# EAGLE design C3427-1 (EAGLE 7.2.0)
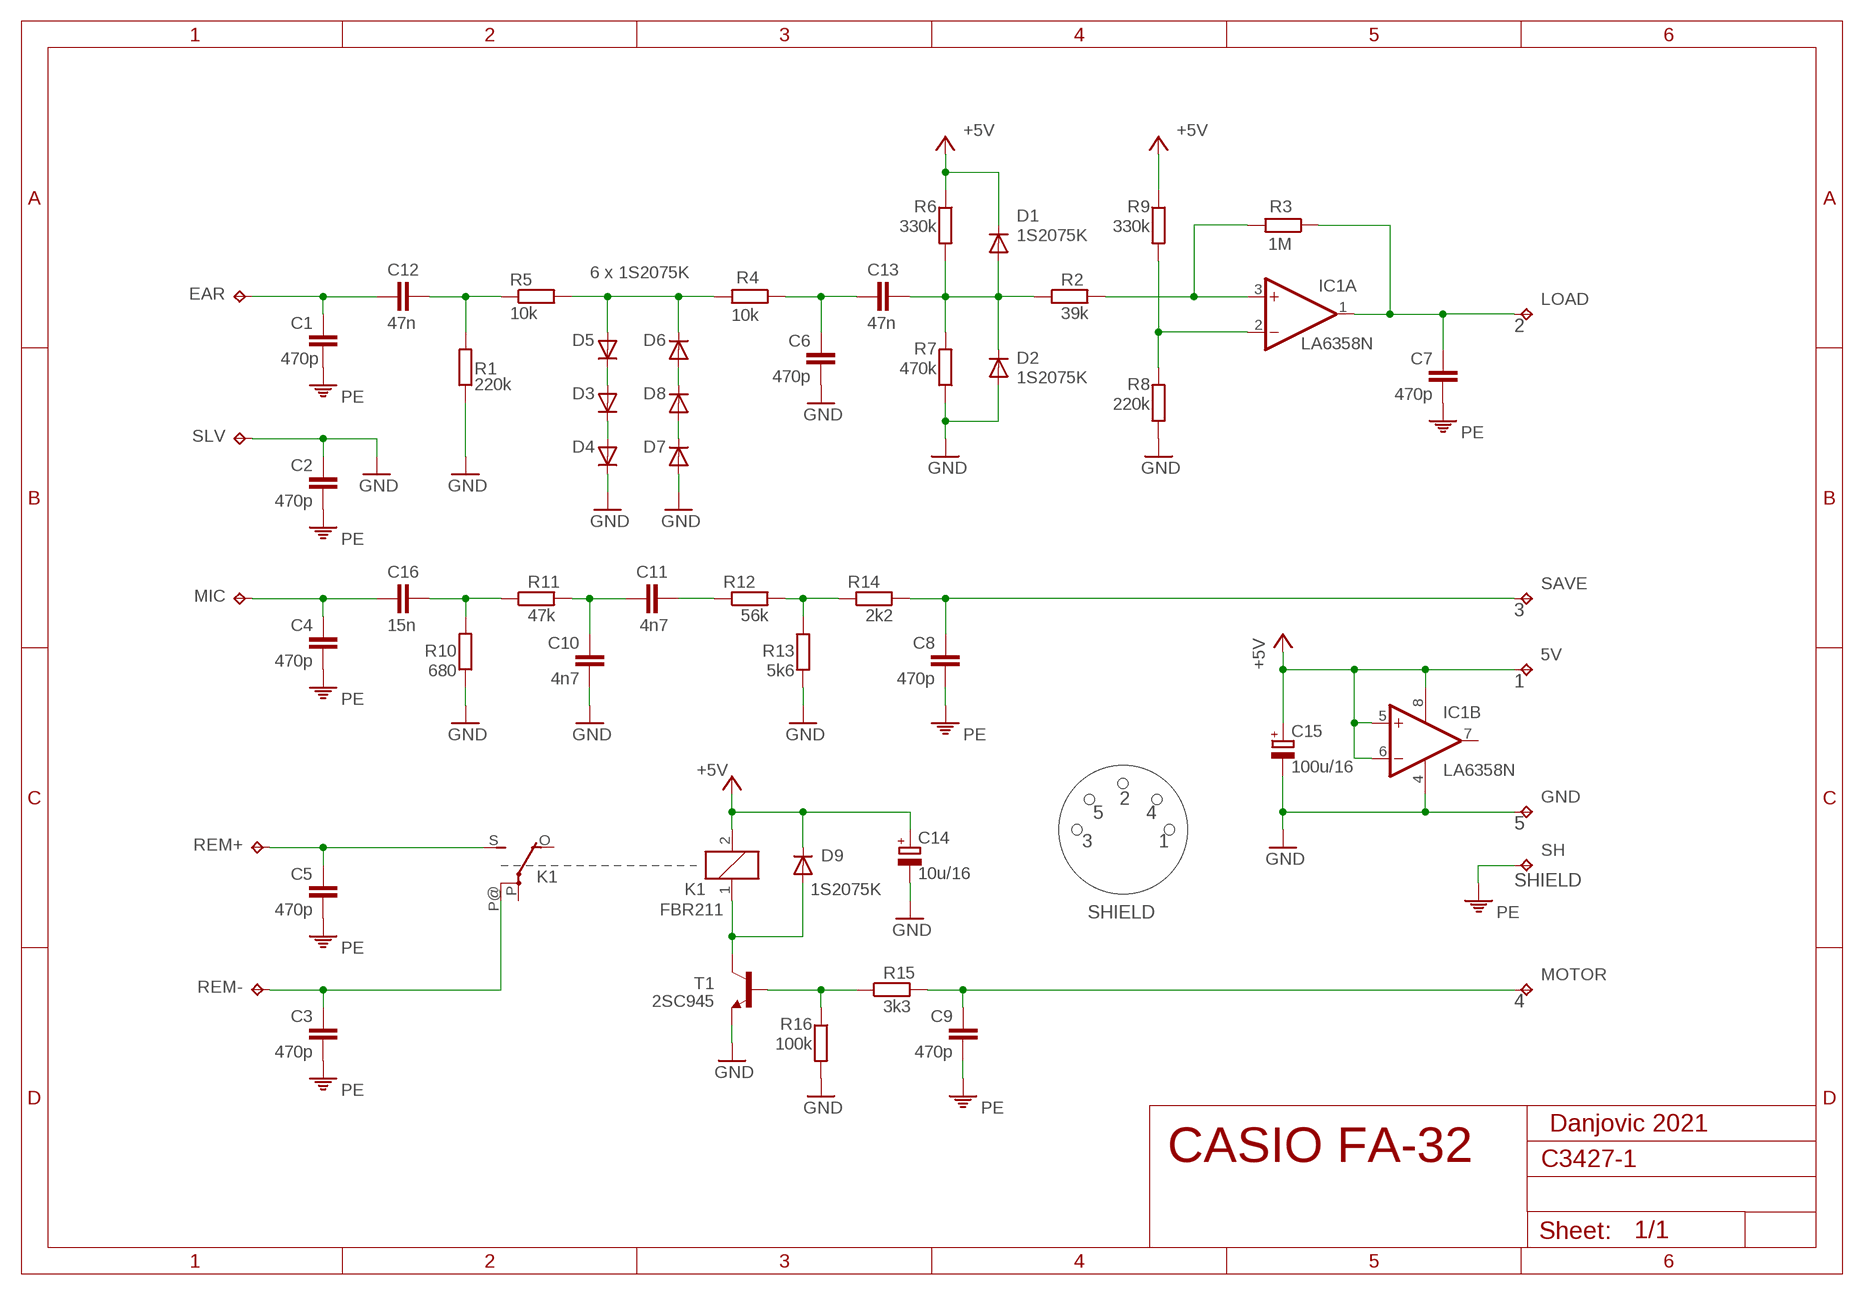
[diagram p0: schematic, sheet 1]

## Parts
5V  TPPAD1-13  [P1-13]
C1  470p  C-EU050-024X044  [C050-024X044]
C2  470p  C-EU050-024X044  [C050-024X044]
C3  470p  C-EU050-024X044  [C050-024X044]
C4  470p  C-EU050-024X044  [C050-024X044]
C5  470p  C-EU050-024X044  [C050-024X044]
C6  470p  C-EU050-024X044  [C050-024X044]
C7  470p  C-EU050-024X044  [C050-024X044]
C8  470p  C-EU050-024X044  [C050-024X044]
C9  470p  C-EU050-024X044  [C050-024X044]
C10  4n7  C-EU050-024X044  [C050-024X044]
C11  4n7  C-EU050-024X044  [C050-024X044]
C12  47n  C-EU050-045X075  [C050-045X075]
C13  47n  C-EU050-045X075  [C050-045X075]
C14  10u/16  CPOL-EUE2-4  [E2-4]
C15  100u/16  CPOL-EUE2.5-6  [E2,5-6]
C16  15n  C-EU050-024X044  [C050-024X044]
D1  1S2075K  DIODE-D-7.5  [D-7.5]
D2  1S2075K  DIODE-D-7.5  [D-7.5]
D3  1S2075K  DIODE-D-7.5  [D-7.5]
D4  1S2075K  DIODE-D-7.5  [D-7.5]
D5  1S2075K  DIODE-D-7.5  [D-7.5]
D6  1S2075K  DIODE-D-7.5  [D-7.5]
D7  1S2075K  DIODE-D-7.5  [D-7.5]
D8  1S2075K  DIODE-D-7.5  [D-7.5]
D9  1S2075K  DIODE-D-7.5  [D-7.5]
EAR  TPPAD1-13  [P1-13]
GND  TPPAD1-13  [P1-13]
IC1  LA6358N  LM358N  [DIL08]
K1  FBR211  FRS1B  [FRS1B]
LOAD  TPPAD1-13  [P1-13]
MIC  TPPAD1-13  [P1-13]
MOTOR  TPPAD1-13  [P1-13]
R1  220k  R-EU_0204/7  [0204/7]
R2  39k  R-EU_0204/7  [0204/7]
R3  1M  R-EU_0204/7  [0204/7]
R4  10k  R-EU_0204/7  [0204/7]
R5  10k  R-EU_0204/7  [0204/7]
R6  330k  R-EU_0204/7  [0204/7]
R7  470k  R-EU_0204/7  [0204/7]
R8  220k  R-EU_0204/7  [0204/7]
R9  330k  R-EU_0204/7  [0204/7]
R10  680  R-EU_0204/7  [0204/7]
R11  47k  R-EU_0204/7  [0204/7]
R12  56k  R-EU_0204/7  [0204/7]
R13  5k6  R-EU_0204/7  [0204/7]
R14  2k2  R-EU_0204/7  [0204/7]
R15  3k3  R-EU_0204/7  [0204/7]
R16  100k  R-EU_0204/7  [0204/7]
REM+  TPPAD1-13  [P1-13]
REM-  TPPAD1-13  [P1-13]
SAVE  TPPAD1-13  [P1-13]
SH  TPPAD1-13  [P1-13]
SLV  TPPAD1-13  [P1-13]
T1  2SC945  [TO92-ECB]

## Nets
+5V: 5V.TP C14.+ C15.+ D1.C D9.C IC1.5(B:+IN) IC1.6(B:-IN) IC1.8(P:V+) K1.2 R6.1 R9.1
GND: C2.2 C6.1 C10.1 C14.- C15.- D2.A D4.C D7.A GND.TP IC1.4(P:V-) R1.1 R7.1 R8.1 R10.1 R13.2 R16.2 SLV.TP T1.E
N$1: C1.2 C12.2 EAR.TP
N$2: D5.A D6.C R4.2 R5.2
N$3: C12.1 R1.2 R5.1
N$4: C6.2 C13.2 R4.1
N$5: C16.1 R10.2 R11.1
N$6: C4.2 C16.2 MIC.TP
N$7: C3.2 K1.P@(2:P) REM-.TP
N$8: C5.2 K1.S(2:S) REM+.TP
N$9: D9.A K1.1 T1.C
N$10: R15.1 R16.1 T1.B
N$11: C9.2 MOTOR.TP R15.2
N$13: C7.2 IC1.1(A:OUT) LOAD.TP R3.1
N$14: C8.2 R14.2 SAVE.TP
N$15: D3.A D5.C
N$16: D3.C D4.A
N$17: D6.A D8.C
N$18: D7.C D8.A
N$19: C13.1 D1.A D2.C R2.1 R6.2 R7.2
N$20: R12.2 R13.1 R14.1
N$21: C10.2 C11.1 R11.2
N$22: C11.2 R12.1
N$23: IC1.2(A:-IN) R8.2 R9.2
N$25: IC1.3(A:+IN) R2.2 R3.2
PE: C1.1 C2.1 C3.1 C4.1 C5.1 C7.1 C8.1 C9.1 SH.TP
Unconnected: IC1.7(B:OUT) K1.O(2:O) K1.P(2:P)

## Notes on the sheet
- 6 x 1S2075K
- 2
- 3
- 1
- 2
- 5 | 4
- 5
- 3 | 1
- SHIELD
- SHIELD
- 4
- Danjovic 2021
- CASIO FA-32

## Library data of the parts
5V EAR GND LOAD MIC MOTOR REM+ REM- SAVE SH SLV = testpad:TP: Test pad
C1-C13 C16 = rcl:C-EU: CAPACITOR, European symbol
C14 C15 = rcl:CPOL-EU: POLARIZED CAPACITOR, European symbol
D1-D9 = diode:DIODE-: DIODE
IC1 = linear:LM358: OP AMP also LM158; LM258; LM2904 Source: http://cache.national.com/ds/LM/LM158.pdf
K1 = relay:FRS1B: RELAY 1 x switch, same as V23101-D6-A201, Siemens; OC_FARNELL: unknown; OC_NEWARK: unknown
R1-R16 = resistor:R-EU_: RESISTOR, European symbol
T1 = transistor:2SC945: NPN Silicon Epitaxial Planar Transistor Source: SEMTECH ELECTRONICS LTD. ... 2SC945 2.pdf

## Board
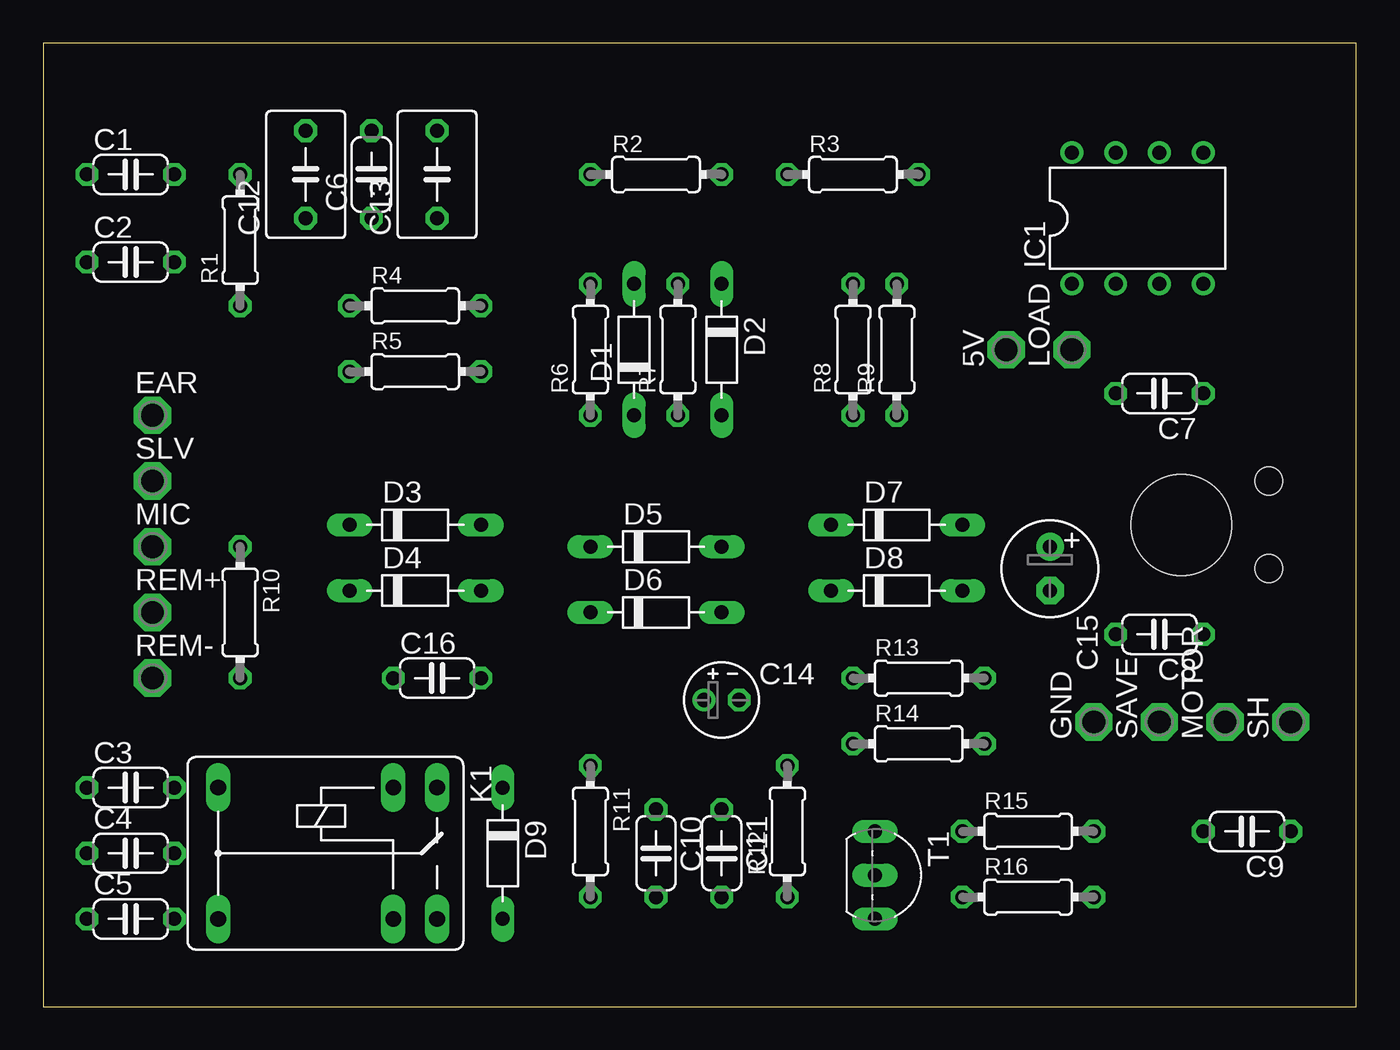
[diagram p1: board, top side]
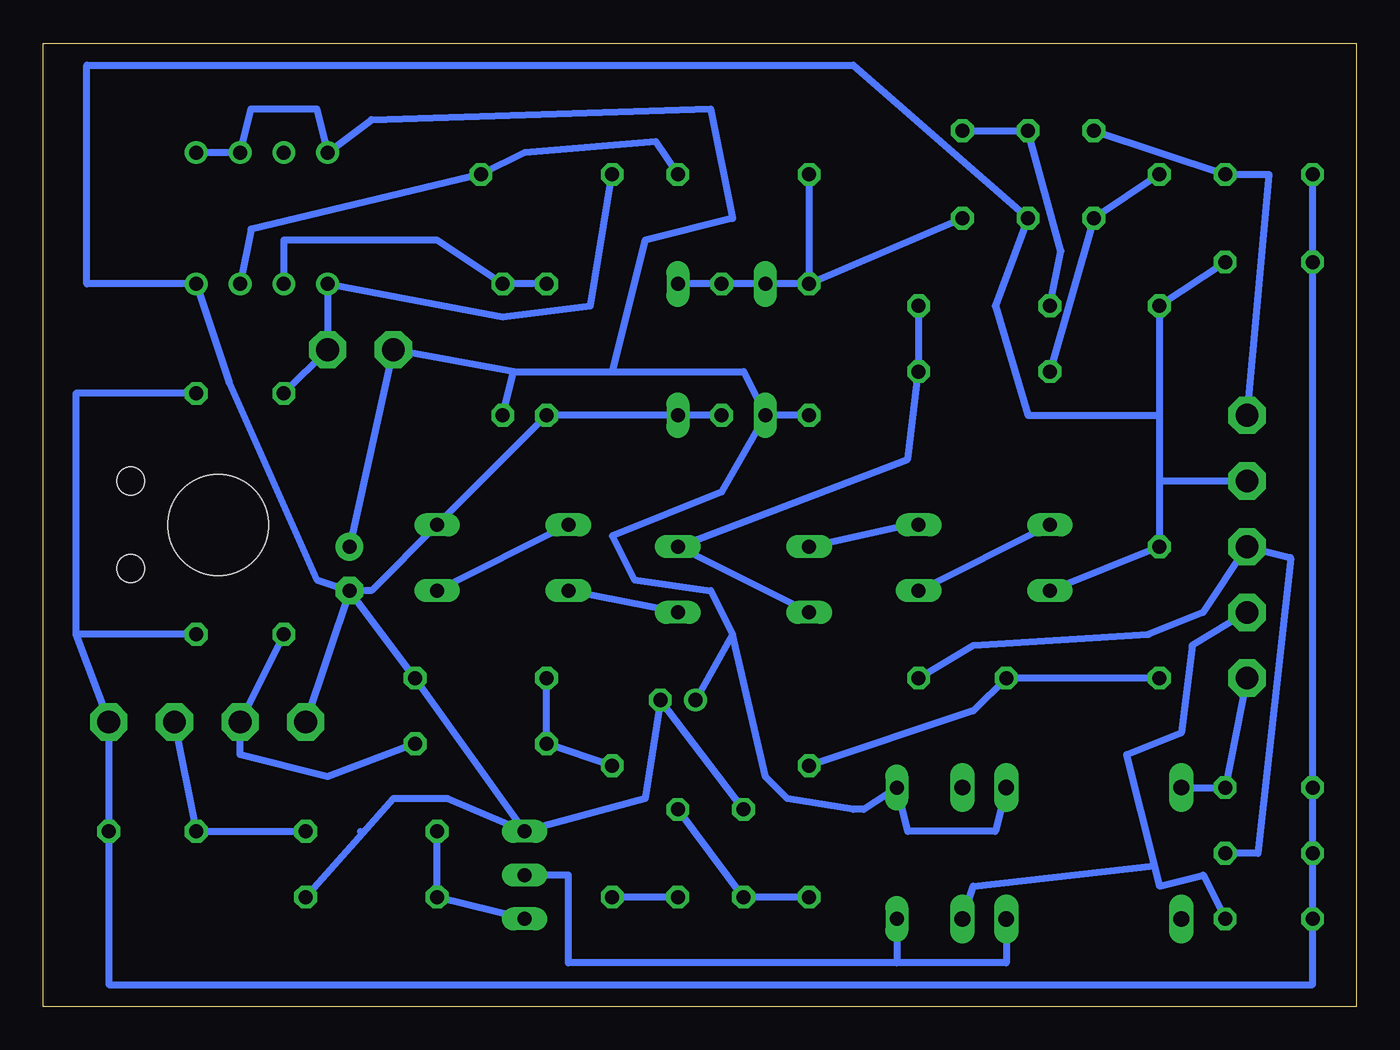
[diagram p2: board, bottom side, seen from below]

Size 76.2 x 55.88 mm. Coordinates in mm from the lower left corner, seen from the top.
Outline: 0,0 76.2,0 76.2,55.88 0,55.88 0,0
Copper layers (1*16): Top 0.035mm / dielectric 1.5mm / Bottom 0.035mm
Design rules "default": minimum track width 10mil, minimum drill 24mil, track to track 8mil, track to pad 8mil, pad to pad 8mil, via to via 8mil, smd to smd 8mil, copper to edge 40mil, drill to drill 8mil, minimum pad ring 10mil, minimum via ring 8mil, stop-mask expansion 4mil, vias tented up to drill 0mil, thermal gap 10mil
Holes 5.84 mm at 66.04,27.94
Holes 1.6 mm at 71.12,30.48 71.12,25.4

### Footprints (pad centres in the part's own frame; a part is rotated, then mirrored left to right if it is on the bottom)
P1-13 = drill 1.321 pad 2.159 octagon: TP 0,0
C050-024X044 = drill 0.813 octagon: 1 -2.54,0; 2 2.54,0
C050-045X075 = drill 0.813 octagon: 1 -2.54,0; 2 2.54,0
E2-4 = drill 0.813 pad 1.27: + -1.016,0 | drill 0.813 pad 1.27 octagon: - 1.016,0
E2,5-6 = drill 0.813 pad 1.6: + -1.27,0 | drill 0.813 pad 1.6 octagon: - 1.27,0
D-7.5 = drill 0.813 long: A 3.81,0; C -3.81,0
DIL08 = drill 0.813 pad 1.27: 1 -3.81,-3.81; 2 -1.27,-3.81; 3 1.27,-3.81; 4 3.81,-3.81; 5 3.81,3.81; 6 1.27,3.81; 7 -1.27,3.81; 8 -3.81,3.81
FRS1B = drill 0.914 long: 1 0,3.81; 2 0,-3.81; O -2.54,-3.81; P 10.16,3.81; P@ 10.16,-3.81; S -2.54,3.81
0204/7 = drill 0.813 octagon: 1 -3.81,0; 2 3.81,0
TO92-ECB = drill 0.813 long: B 2.54,0; C 0,0; E -2.54,0

### Placement (x,y rotation side)
5V  55.88,38.1 90 top
C1  5.08,48.26 0 top
C2  5.08,43.18 0 top
C3  5.08,12.7 0 top
C4  5.08,8.89 0 top
C5  5.08,5.08 0 top
C6  19.05,48.26 90 top
C7  64.77,35.56 180 top
C8  64.77,21.59 180 top
C9  69.85,10.16 180 top
C10  35.56,8.89 270 top
C11  39.37,8.89 270 top
C12  15.24,48.26 90 top
C13  22.86,48.26 90 top
C14  39.37,17.78 0 top
C15  58.42,25.4 270 top
C16  22.86,19.05 0 top
D1  34.29,38.1 90 top
D2  39.37,38.1 270 top
D3  21.59,27.94 0 top
D4  21.59,24.13 0 top
D5  35.56,26.67 0 top
D6  35.56,22.86 0 top
D7  49.53,27.94 0 top
D8  49.53,24.13 0 top
D9  26.67,8.89 270 top
EAR  6.35,34.29 0 top
GND  60.96,16.51 90 top
IC1  63.5,45.72 0 top
K1  20.32,8.89 180 top
LOAD  59.69,38.1 90 top
MIC  6.35,26.67 0 top
MOTOR  68.58,16.51 90 top
R1  11.43,44.45 90 top
R2  35.56,48.26 0 top
R3  46.99,48.26 0 top
R4  21.59,40.64 0 top
R5  21.59,36.83 0 top
R6  31.75,38.1 90 top
R7  36.83,38.1 90 top
R8  46.99,38.1 90 top
R9  49.53,38.1 90 top
R10  11.43,22.86 270 top
R11  31.75,10.16 270 top
R12  43.18,10.16 90 top
R13  50.8,19.05 0 top
R14  50.8,15.24 0 top
R15  57.15,10.16 0 top
R16  57.15,6.35 0 top
REM+  6.35,22.86 0 top
REM-  6.35,19.05 0 top
SAVE  64.77,16.51 90 top
SH  72.39,16.51 90 top
SLV  6.35,30.48 0 top
T1  48.26,7.62 270 top

### Tracks (layer width: path | path; a pad name or v marks a point on that pad's centre or on a via)
+5V
  Bottom 0.406: K1.2 20.95,10.16 26.04,10.16 D9.C 28.57,11.43 29.21,11.43 33.02,12.06 34.29,13.34 36.2,21.59 | IC1.5 IC1.6 64.14,52.07 60.33,52.07 IC1.8 57.15,51.44 37.47,52.07 36.2,45.72 41.27,44.45 43.18,36.83 | R6.1 D1.C | D1.C 36.83,29.84 43.18,27.3 41.91,24.77 37.47,24.13 36.2,21.59 | 36.2,21.59 C14.+ | C15.+ 5V.TP 48.9,36.83 | R9.1 48.9,36.83 | 48.9,36.83 43.18,36.83 | 43.18,36.83 35.56,36.83 D1.C
GND
  Bottom 0.406: T1.E 52.7,12.06 55.88,12.06 57.67,10.05 | 57.67,10.05 R16.2 | 57.78,10.16 57.67,10.05 | C2.2 R1.1 11.43,34.29 | SLV.TP 11.43,30.48 | 11.43,30.48 R10.1 D4.C | 11.43,34.29 11.43,30.48 | 11.43,34.29 19.05,34.29 20.95,40.64 C6.1 29.21,54.61 73.66,54.61 73.66,41.91 IC1.4 65.41,36.2 60.33,24.77 C15.- | C15.- GND.TP | C15.- 57.15,24.13 D7.A R8.1 D2.A R7.1 | C10.1 C14.- 41.27,12.06 T1.E | C15.- R13.2 T1.E
N$1
  Bottom 0.406: C12.2 C1.2 5.08,48.26 EAR.TP
N$2
  Bottom 0.406: R4.2 R5.2 26.04,31.75 D5.A D6.C
N$3
  Bottom 0.406: R1.2 C12.1 R5.1
N$4
  Bottom 0.406: R4.1 17.14,43.81 C6.2 C13.2
N$5
  Bottom 0.406: R10.2 C16.1 22.23,17.14 R11.1
N$6
  Bottom 0.406: C4.2 5.71,8.89 3.81,26.04 MIC.TP 8.89,22.86 12.06,21.59 22.23,20.95 C16.2
N$7
  Bottom 0.406: REM-.TP C3.2 K1.P@
N$8
  Bottom 0.406: REM+.TP 9.53,20.95 10.16,15.88 13.34,14.61 11.73,8.18 | 11.73,8.18 11.43,6.99 8.89,7.62 C5.2 | K1.S 22.23,6.99 11.73,8.18
N$9
  Bottom 0.406: K1.1 20.32,2.54 26.67,2.54 | 26.67,2.54 45.72,2.54 45.72,7.62 T1.C | D9.A 26.67,2.54
N$10
  Bottom 0.406: T1.B R16.1 R15.1
N$11
  Bottom 0.406: MOTOR.TP C9.2 R15.2
N$13
  Bottom 0.406: C7.2 LOAD.TP IC1.1 49.53,40.01 44.45,40.64 R3.1
N$14
  Bottom 0.406: R14.2 59.69,13.34 64.77,14.61 SAVE.TP C8.2
N$15
  Bottom 0.406: D5.C 26.04,27.94 D3.A
N$16
  Bottom 0.406: D4.A D3.C
N$17
  Bottom 0.406: D6.A D8.C
N$18
  Bottom 0.406: D7.C D8.A
N$19
  Bottom 0.406: C13.1 R6.2 | R6.2 D1.A R7.2 D2.C | R2.1 R6.2
N$20
  Bottom 0.406: R12.2 R14.1 R13.1
N$21
  Bottom 0.406: R11.2 C10.2 C11.1
N$22
  Bottom 0.406: C11.2 R12.1
N$23
  Bottom 0.406: R8.2 R9.2 53.34,44.45 62.23,44.45 IC1.2
N$25
  Bottom 0.406: IC1.3 64.14,45.09 R3.2 48.26,49.53 40.64,50.16 R2.2
PE
  Bottom 0.406: C1.1 C2.1 C3.1 C4.1 C5.1 2.54,1.27 72.39,1.27 C9.1 SH.TP 74.3,21.59 | C8.1 74.3,21.59 | C7.1 74.3,35.56 74.3,21.59